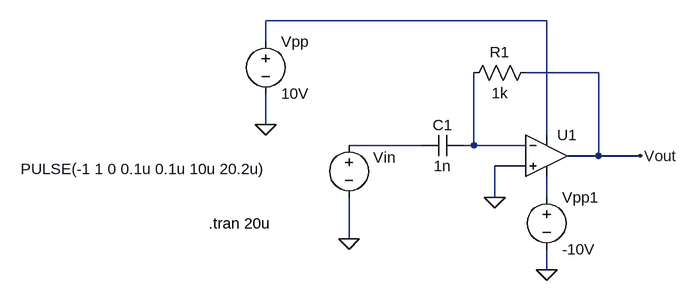
[diagram p0: schematic Integrator_op_amp.asc]
Integrator_op_amp.asc, the LTspice schematic file:
Version 4
SHEET 1 880 680
WIRE 256 -32 -176 -32
WIRE -176 0 -176 -32
WIRE 336 48 224 48
WIRE -176 128 -176 80
WIRE 256 144 256 -32
WIRE 64 160 -48 160
WIRE 144 160 144 48
WIRE 144 160 128 160
WIRE 224 160 144 160
WIRE 336 176 336 48
WIRE 336 176 288 176
WIRE 400 176 336 176
WIRE 224 192 176 192
WIRE 176 240 176 192
WIRE 256 240 256 208
WIRE -48 304 -48 240
WIRE 256 352 256 320
FLAG -176 128 0
FLAG -48 304 0
FLAG 256 352 0
FLAG 400 176 Vout
FLAG 176 240 0
SYMBOL Opamps\\UniversalOpamp2 256 176 R0
SYMATTR InstName U1
SYMBOL voltage -48 144 R0
WINDOW 123 24 124 Left 2
WINDOW 39 0 0 Left 0
WINDOW 0 37 35 Left 2
WINDOW 3 -505 52 Left 2
SYMATTR InstName Vin
SYMATTR Value PULSE(-1 1 0 0.1u 0.1u 10u 20.2u)
SYMBOL cap 128 144 R90
WINDOW 0 0 32 VBottom 2
WINDOW 3 32 32 VTop 2
SYMATTR InstName C1
SYMATTR Value 1n
SYMBOL res 240 32 R90
WINDOW 0 0 56 VBottom 2
WINDOW 3 32 56 VTop 2
SYMATTR InstName R1
SYMATTR Value 1k
SYMBOL voltage -176 -16 R0
WINDOW 123 0 0 Left 0
WINDOW 39 0 0 Left 0
SYMATTR InstName Vpp
SYMATTR Value 10V
SYMBOL voltage 256 224 R0
WINDOW 123 0 0 Left 0
WINDOW 39 0 0 Left 0
SYMATTR InstName Vpp1
SYMATTR Value -10V
TEXT -264 280 Left 2 !.tran 20u

The netlist it stands for:
* Integrator_op_amp.asc
XU1 0 N003 N001 N004 Vout level.2 Avol=1Meg GBW=10Meg Slew=10Meg ilimit=25m rail=0 Vos=0 phimargin=45 en=0 enk=0 in=0 ink=0 Rin=500Meg  ; pins IN+ IN- V+ V- OUT
Vin N002 0 PULSE(-1 1 0 0.1u 0.1u 10u 20.2u)
C1 N003 N002 1n
R1 Vout N003 1k
Vpp N001 0 10V
Vpp1 N004 0 -10V
.tran 20u
.lib UniversalOpamps2.sub
.backanno
.end